# Altium schematic sheet LoRA_RA02.SchDoc
size A; SheetNumber: 5; SheetTotal: 5
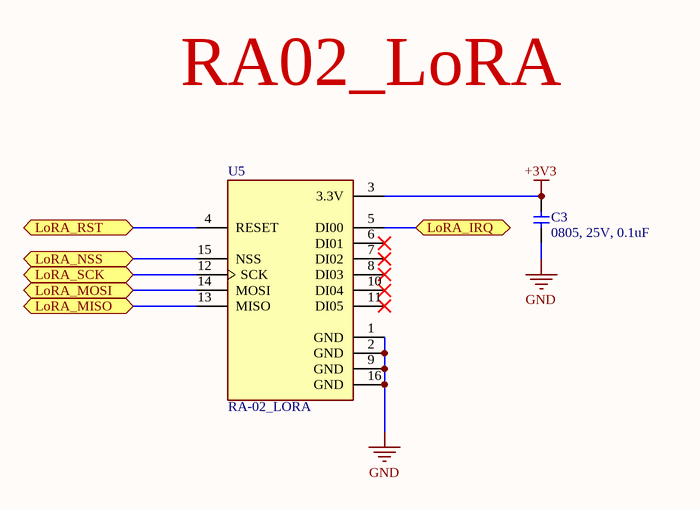
[diagram p0: LoRA_RA02.SchDoc]

## Parts
C3  0805, 25V, 0.1uF  [C0805]
U5  RA-02_LORA  [MODULE_RA-02_LORA - duplicate]

## Ports
LoRA_IRQ (bidir), LoRA_MISO (bidir), LoRA_MOSI (bidir), LoRA_NSS (bidir), LoRA_RST (bidir), LoRA_SCK (bidir)

## Nets
+3V3: C3.2 U5.3(3.3V)
GND: C3.1 U5.1(GND) U5.2(GND) U5.9(GND) U5.16(GND)
LoRA_IRQ: U5.5(DI00) ; port LoRA_IRQ
LoRA_MISO: U5.13(MISO) ; port LoRA_MISO
LoRA_MOSI: U5.14(MOSI) ; port LoRA_MOSI
LoRA_NSS: U5.15(NSS) ; port LoRA_NSS
LoRA_RST: U5.4(RESET) ; port LoRA_RST
LoRA_SCK: U5.12(SCK) ; port LoRA_SCK

Not connected (* = marked no-connect by the designer): U5 6(DI01)* 7(DI02)* 8(DI03)* 10(DI04)* 11(DI05)*

## Notes on the sheet
- RA02_LoRA

## Library data of the parts
C3 = C0805: Part Number: *; MFR: *
U5 = RA-02_LORA: Ra-02 LoRa RF M5Stack Platform Evaluation Expansion Board; Price: None; Availability: Unavailable; MP: RA-02_LORA; Value: *; Package: None